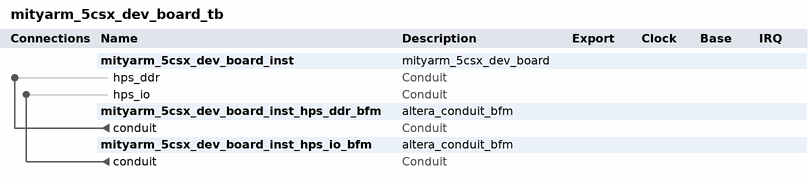
[diagram p0: system contents]
# Platform Designer (Qsys) system mityarm_5csx_dev_board_tb, Cyclone V 5CSXFC6C6U23C8ES
# Parameters at their usual value, and those the tool derives, are not listed.
package require -exact qsys 13.1
create_system mityarm_5csx_dev_board_tb
set_project_property DEVICE_FAMILY {Cyclone V}
set_project_property DEVICE 5CSXFC6C6U23C8ES

add_instance mityarm_5csx_dev_board_inst mityarm_5csx_dev_board 1.0

add_instance mityarm_5csx_dev_board_inst_hps_ddr_bfm altera_conduit_bfm 13.1
set_instance_parameter_value mityarm_5csx_dev_board_inst_hps_ddr_bfm CLOCKED_SIGNAL false
set_instance_parameter_value mityarm_5csx_dev_board_inst_hps_ddr_bfm ENABLE_RESET false
set_instance_parameter_value mityarm_5csx_dev_board_inst_hps_ddr_bfm SIGNAL_ROLES mem_a,mem_ba,mem_ck,mem_ck_n,mem_cke,mem_cs_n,mem_ras_n,mem_cas_n,mem_we_n,mem_reset_n,mem_dq,mem_dqs,mem_dqs_n,mem_odt,mem_dm,oct_rzqin
set_instance_parameter_value mityarm_5csx_dev_board_inst_hps_ddr_bfm SIGNAL_WIDTHS 15,3,1,1,1,1,1,1,1,1,40,5,5,1,5,1
set_instance_parameter_value mityarm_5csx_dev_board_inst_hps_ddr_bfm SIGNAL_DIRECTIONS input,input,input,input,input,input,input,input,input,input,bidir,bidir,bidir,input,input,output

add_instance mityarm_5csx_dev_board_inst_hps_io_bfm altera_conduit_bfm 13.1
set_instance_parameter_value mityarm_5csx_dev_board_inst_hps_io_bfm CLOCKED_SIGNAL false
set_instance_parameter_value mityarm_5csx_dev_board_inst_hps_io_bfm ENABLE_RESET false
set_instance_parameter_value mityarm_5csx_dev_board_inst_hps_io_bfm SIGNAL_ROLES hps_io_emac1_inst_TX_CLK,hps_io_emac1_inst_TXD0,hps_io_emac1_inst_TXD1,hps_io_emac1_inst_TXD2,hps_io_emac1_inst_TXD3,hps_io_emac1_inst_RXD0,hps_io_emac1_inst_MDIO,hps_io_emac1_inst_MDC,hps_io_emac1_inst_RX_CTL,hps_io_emac1_inst_TX_CTL,hps_io_emac1_inst_RX_CLK,hps_io_emac1_inst_RXD1,hps_io_emac1_inst_RXD2,hps_io_emac1_inst_RXD3,hps_io_qspi_inst_SS1,hps_io_qspi_inst_IO0,hps_io_qspi_inst_IO1,hps_io_qspi_inst_IO2,hps_io_qspi_inst_IO3,hps_io_qspi_inst_SS0,hps_io_qspi_inst_CLK,hps_io_sdio_inst_CMD,hps_io_sdio_inst_D0,hps_io_sdio_inst_D1,hps_io_sdio_inst_CLK,hps_io_sdio_inst_D2,hps_io_sdio_inst_D3,hps_io_usb1_inst_D0,hps_io_usb1_inst_D1,hps_io_usb1_inst_D2,hps_io_usb1_inst_D3,hps_io_usb1_inst_D4,hps_io_usb1_inst_D5,hps_io_usb1_inst_D6,hps_io_usb1_inst_D7,hps_io_usb1_inst_CLK,hps_io_usb1_inst_STP,hps_io_usb1_inst_DIR,hps_io_usb1_inst_NXT,hps_io_uart0_inst_RX,hps_io_uart0_inst_TX,hps_io_i2c0_inst_SDA,hps_io_i2c0_inst_SCL,hps_io_i2c1_inst_SDA,hps_io_i2c1_inst_SCL,hps_io_can0_inst_RX,hps_io_can0_inst_TX,hps_io_can1_inst_RX,hps_io_can1_inst_TX,hps_io_gpio_inst_GPIO00,hps_io_gpio_inst_GPIO09,hps_io_gpio_inst_GPIO28,hps_io_gpio_inst_GPIO37,hps_io_gpio_inst_GPIO40,hps_io_gpio_inst_GPIO41,hps_io_gpio_inst_GPIO48,hps_io_gpio_inst_GPIO49,hps_io_gpio_inst_GPIO50
set_instance_parameter_value mityarm_5csx_dev_board_inst_hps_io_bfm SIGNAL_WIDTHS 1,1,1,1,1,1,1,1,1,1,1,1,1,1,1,1,1,1,1,1,1,1,1,1,1,1,1,1,1,1,1,1,1,1,1,1,1,1,1,1,1,1,1,1,1,1,1,1,1,1,1,1,1,1,1,1,1,1
set_instance_parameter_value mityarm_5csx_dev_board_inst_hps_io_bfm SIGNAL_DIRECTIONS input,input,input,input,input,output,bidir,input,output,input,output,output,output,output,input,bidir,bidir,bidir,bidir,input,input,bidir,bidir,bidir,input,bidir,bidir,bidir,bidir,bidir,bidir,bidir,bidir,bidir,bidir,output,input,output,output,output,input,bidir,bidir,bidir,bidir,output,input,output,input,bidir,bidir,bidir,bidir,bidir,bidir,bidir,bidir,bidir

# connections
add_connection mityarm_5csx_dev_board_inst_hps_ddr_bfm.conduit mityarm_5csx_dev_board_inst.hps_ddr conduit
add_connection mityarm_5csx_dev_board_inst_hps_io_bfm.conduit mityarm_5csx_dev_board_inst.hps_io conduit

set_interconnect_requirement {$system} qsys_mm.clockCrossingAdapter HANDSHAKE
set_interconnect_requirement {$system} qsys_mm.maxAdditionalLatency 1
set_interconnect_requirement {$system} qsys_mm.insertDefaultSlave false

save_system mityarm_5csx_dev_board_tb.qsys
